# EAGLE design rfid_module_v3 (EAGLE 8.0.1)

## Sheet 1 of 2: RFID Module V3
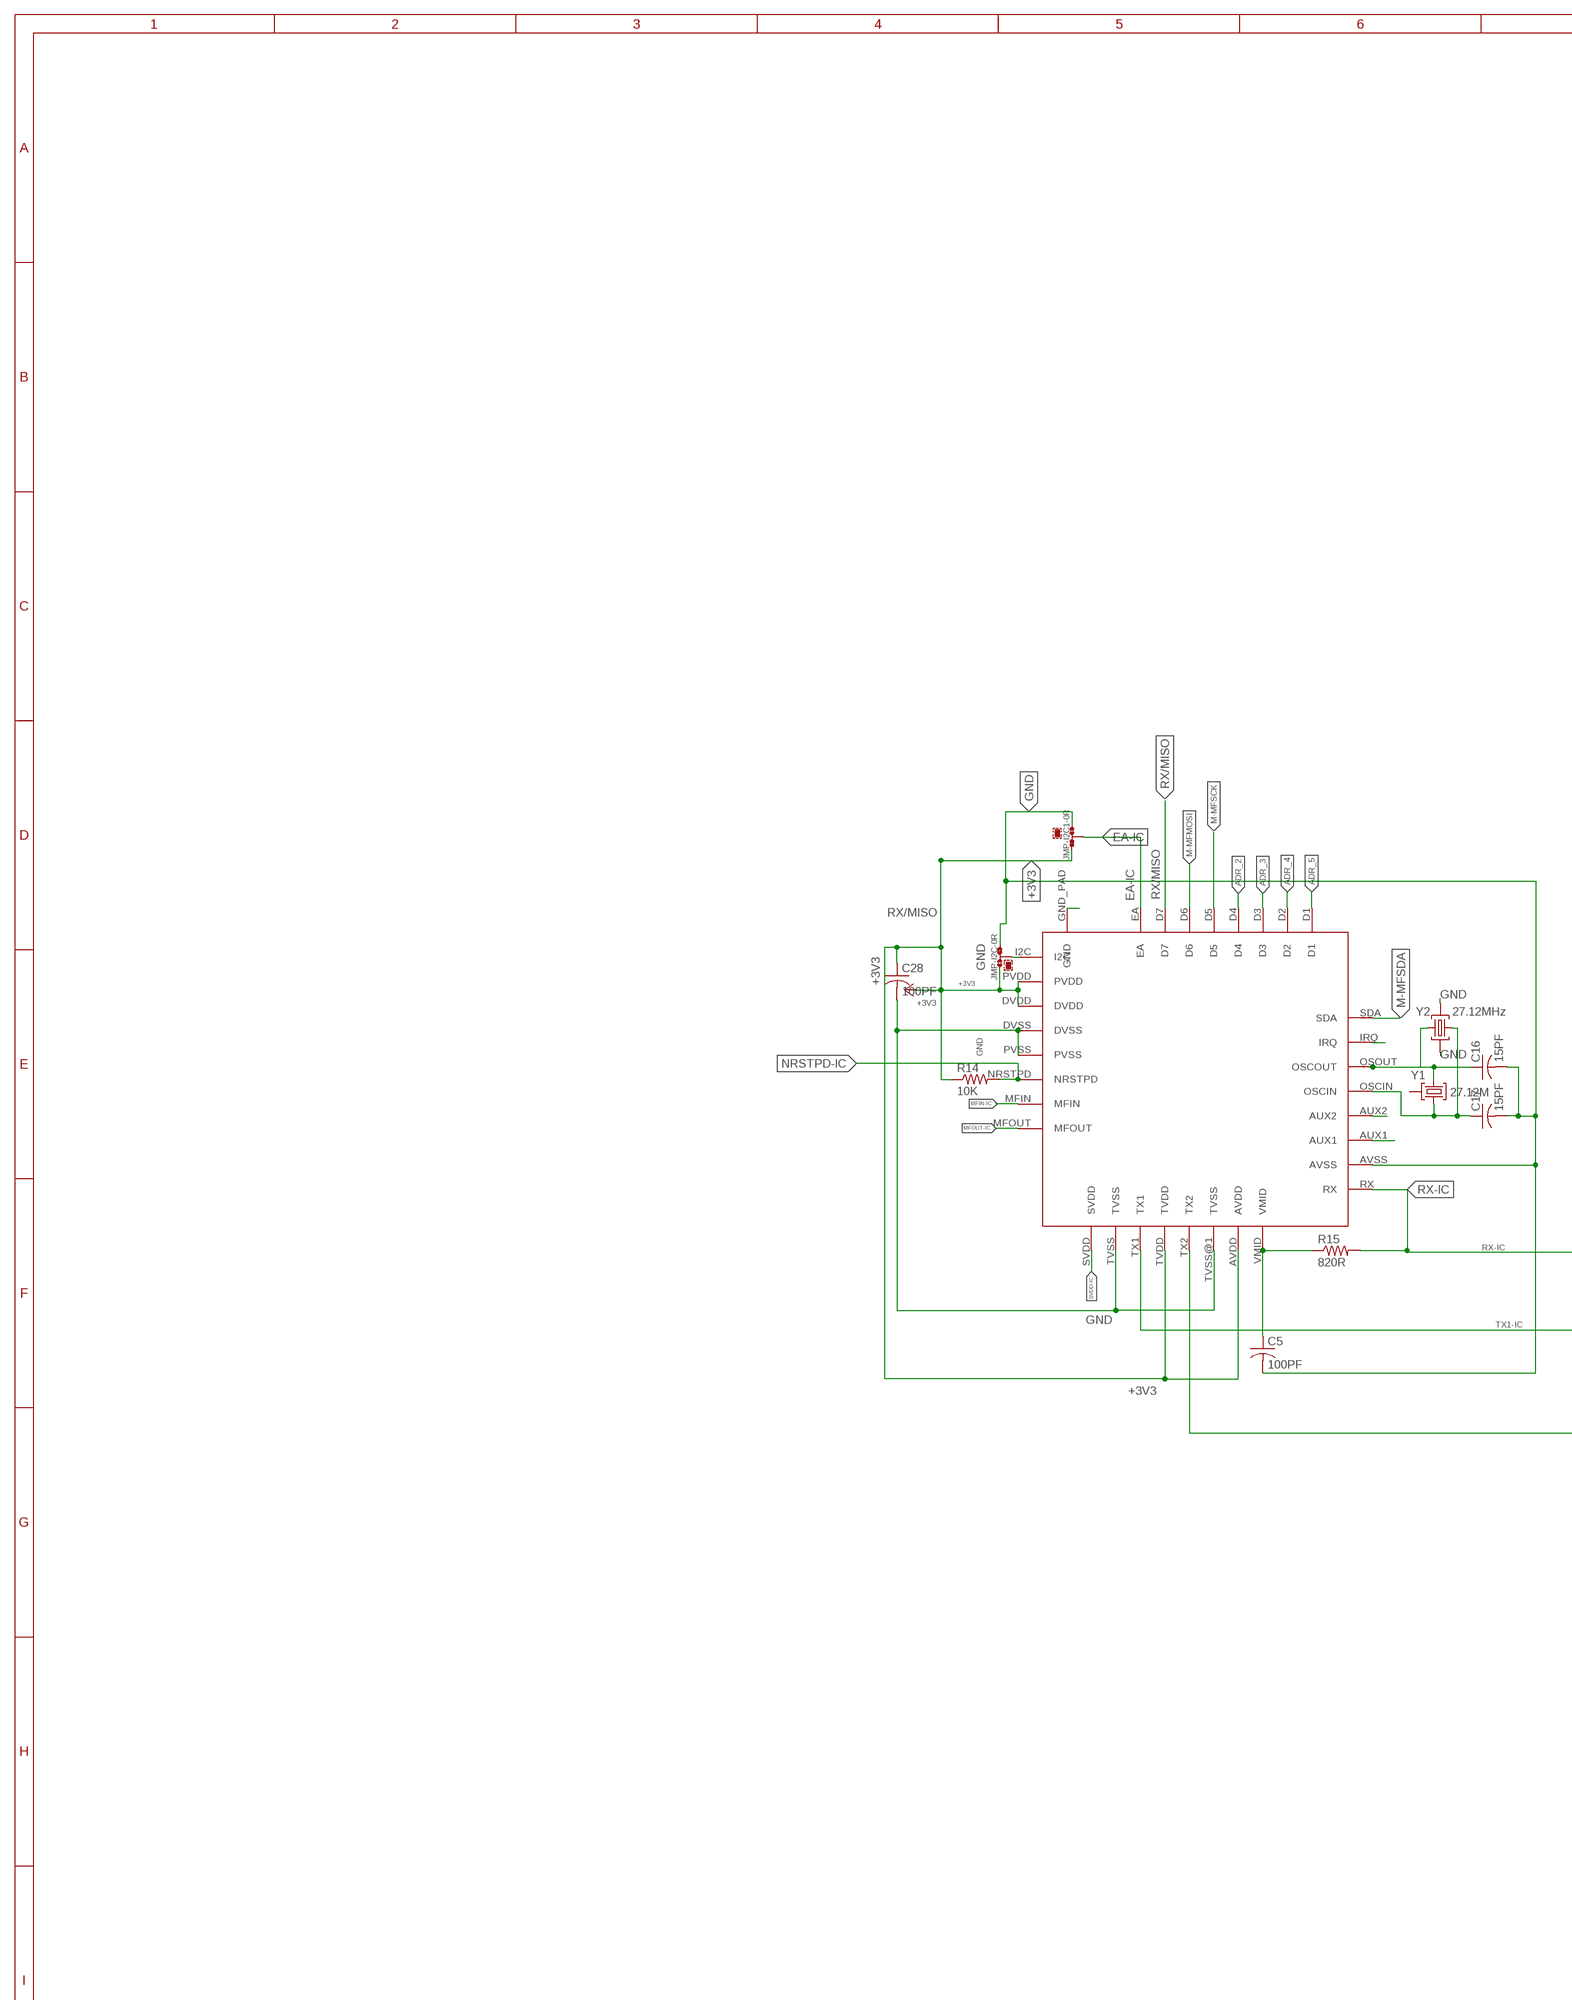
[diagram p0: schematic, sheet 1, part 1 of 2]
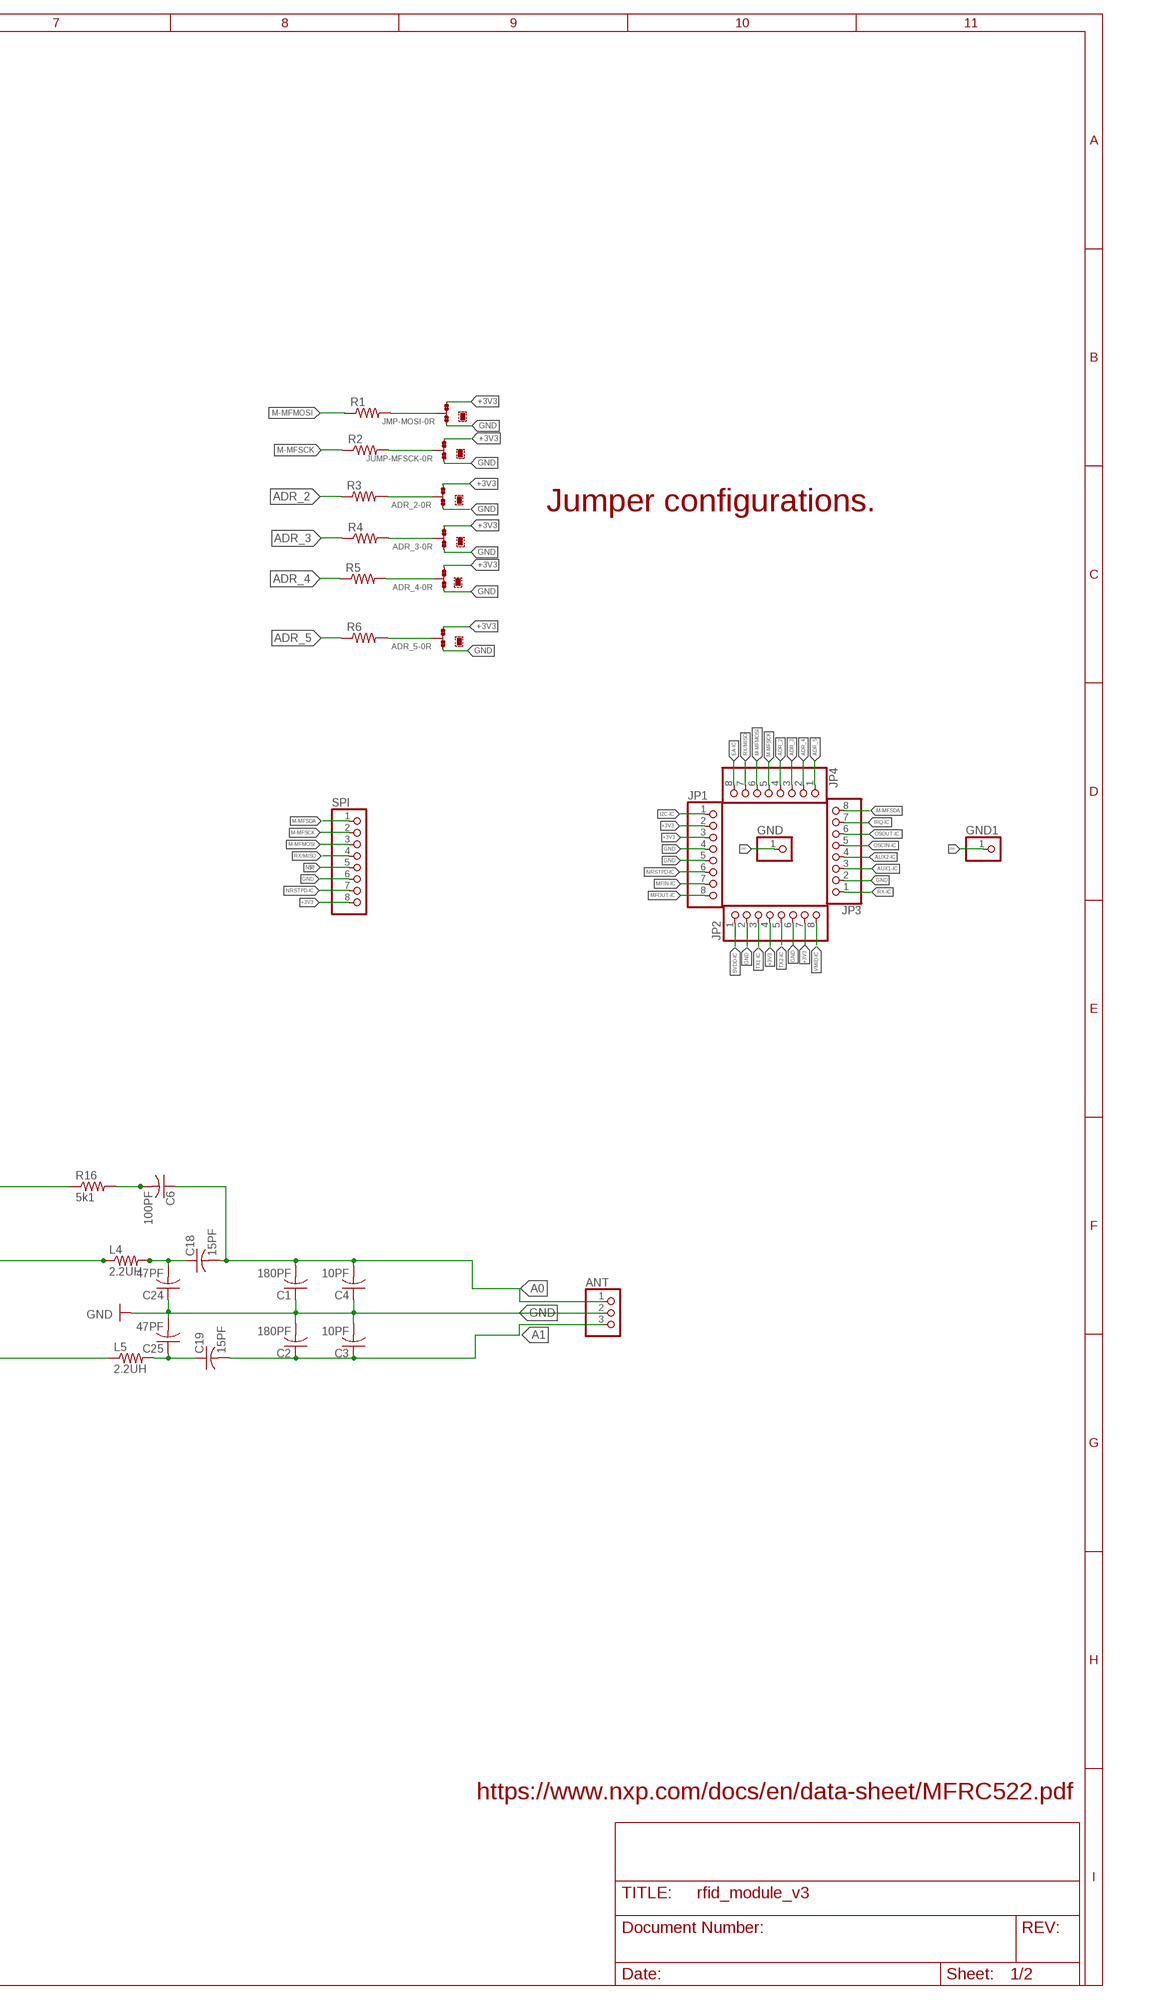
[diagram p1: schematic, sheet 1, part 2 of 2]

### Parts
ADR_2  0R-JUMPA  [A0R-JMP]
ADR_3  0R-JUMPA  [A0R-JMP]
ADR_4  0R-JUMPA  [A0R-JMP]
ADR_5  0R-JUMPA  [A0R-JMP]
ANT  PINHD-1X3  [1X03]
C1  180PF  C-USC0603  [C0603]
C2  180PF  C-USC0603  [C0603]
C3  10PF  C-USC0603  [C0603]
C4  10PF  C-USC0603  [C0603]
C5  100PF  C-USC0603  [C0603]
C6  100PF  C-USC0603  [C0603]
C16  15PF  C-USC0603  [C0603]
C17  15PF  C-USC0603  [C0603]
C18  15PF  C-USC0603  [C0603]
C19  15PF  C-USC0603  [C0603]
C24  47PF  C-USC0603  [C0603]
C25  47PF  C-USC0603  [C0603]
C28  100PF  C-USC0603  [C0603]
GND  PINHD-1X1  [1X01]
GND1  PINHD-1X1  [1X01]
JMP-I2C  0R-JUMPA  [A0R-JMP]
JMP-I2C1  JMP-EA  0R-JUMPA  [A0R-JMP]
JMP-MOSI  0R-JUMPA  [A0R-JMP]
JP1  PINHD-1X8  [1X08]
JP2  PINHD-1X8  [1X08]
JP3  PINHD-1X8  [1X08]
JP4  PINHD-1X8  [1X08]
JUMP-MFSCK  0R-JUMPA  [A0R-JMP]
L4  2.2UH  R-US_R0603  [R0603]
L5  2.2UH  R-US_R0603  [R0603]
R1  R-US_R0603  [R0603]
R2  R-US_R0603  [R0603]
R3  R-US_R0603  [R0603]
R4  R-US_R0603  [R0603]
R5  R-US_R0603  [R0603]
R6  R-US_R0603  [R0603]
R14  10K  R-US_R0603  [R0603]
R15  820R  R-US_R0603  [R0603]
R16  5k1  R-US_R0603  [R0603]
SPI  PINHD-1X8  [1X08]
U$1  MFRC522  [MFRC522]
Y1  27.12M  CRYSTAL  [RAD3LEAD]
Y2  27.12MHz  CRYSTAL-3.2-2.5  [CRYSTAL-3.2-2.5]

### Nets
+3V3: ADR_2.3 ADR_3.3 ADR_4.3 ADR_5.3 C28.1 JMP-I2C1.3 JMP-I2C.3 JMP-MOSI.3 JP1.2 JP1.3 JP2.4 JP2.7 JUMP-MFSCK.3 R14.1 SPI.8 U$1.AVDD U$1.DVDD U$1.PVDD U$1.TVDD ; supply symbol labelled +3.3V
A0: ANT.1 C1.2 C4.2 C6.1 C18.2
A1: ANT.3 C2.1 C3.1 C19.2
ADR_2: JP4.4 R3.1 U$1.D4
ADR_3: JP4.3 R4.1 U$1.D3
ADR_4: JP4.2 R5.1 U$1.D2
ADR_5: JP4.1 R6.1 U$1.D1
AUX1-IC: JP3.3 U$1.AUX1
AUX2-IC: JP3.4 U$1.AUX2
EA-IC: JMP-I2C1.2 JP4.8 U$1.EA
GND: ADR_2.1 ADR_3.1 ADR_4.1 ADR_5.1 ANT.2 C1.1 C2.2 C3.2 C4.1 C5.2 C16.2 C17.2 C24.1 C25.2 C28.2 GND1.1 GND.1 JMP-I2C1.1 JMP-I2C.1 JMP-MOSI.1 JP1.4 JP1.5 JP2.2 JP2.6 JP3.2 JUMP-MFSCK.1 SPI.6 U$1.AVSS U$1.DVSS U$1.GND_PAD(GND) U$1.PVSS U$1.TVSS U$1.TVSS@1(TVSS) Y2.2(GND) Y2.4(GND)
I2C-IC: JMP-I2C.2 JP1.1 U$1.I2C
IRQ-IC: JP3.7 U$1.IRQ
M-MFMOSI: JP4.6 R1.1 SPI.3 U$1.D6
M-MFSCK: JP4.5 R2.1 SPI.2 U$1.D5
M-MFSDA: JP3.8 SPI.1 U$1.SDA
MFIN-IC: JP1.7 U$1.MFIN
MFOUT-IC: JP1.8 U$1.MFOUT
N$2: C18.1 C24.2 L4.2
N$4: JMP-MOSI.2 R1.2
N$6: C19.1 C25.1 L5.2
N$8: SPI.5
N$9: JUMP-MFSCK.2 R2.2
N$10: C6.2 R16.2
N$11: ADR_2.2 R3.2
N$12: ADR_3.2 R4.2
N$13: ADR_4.2 R5.2
N$14: ADR_5.2 R6.2
NRSTPD-IC: JP1.6 R14.2 SPI.7 U$1.NRSTPD
OSCIN-IC: C17.1 JP3.5 U$1.OSCIN Y1.1 Y2.1(C1)
OSOUT-IC: C16.1 JP3.6 U$1.OSOUT(OSCOUT) Y1.3 Y2.3(C2)
RX-IC: JP3.1 R15.2 R16.1 U$1.RX
RX/MISO: JP4.7 SPI.4 U$1.D7
SVDD-IC: JP2.1 U$1.SVDD
TX1-IC: JP2.3 L4.1 U$1.TX1
TX2-IC: JP2.5 L5.1 U$1.TX2
VMID-IC: C5.1 JP2.8 R15.1 U$1.VMID
Unconnected: Y1.2

### Notes on the sheet
- Jumper configurations.
- https://www.nxp.com/docs/en/data-sheet/MFRC522.pdf

## Sheet 2 of 2: Notes
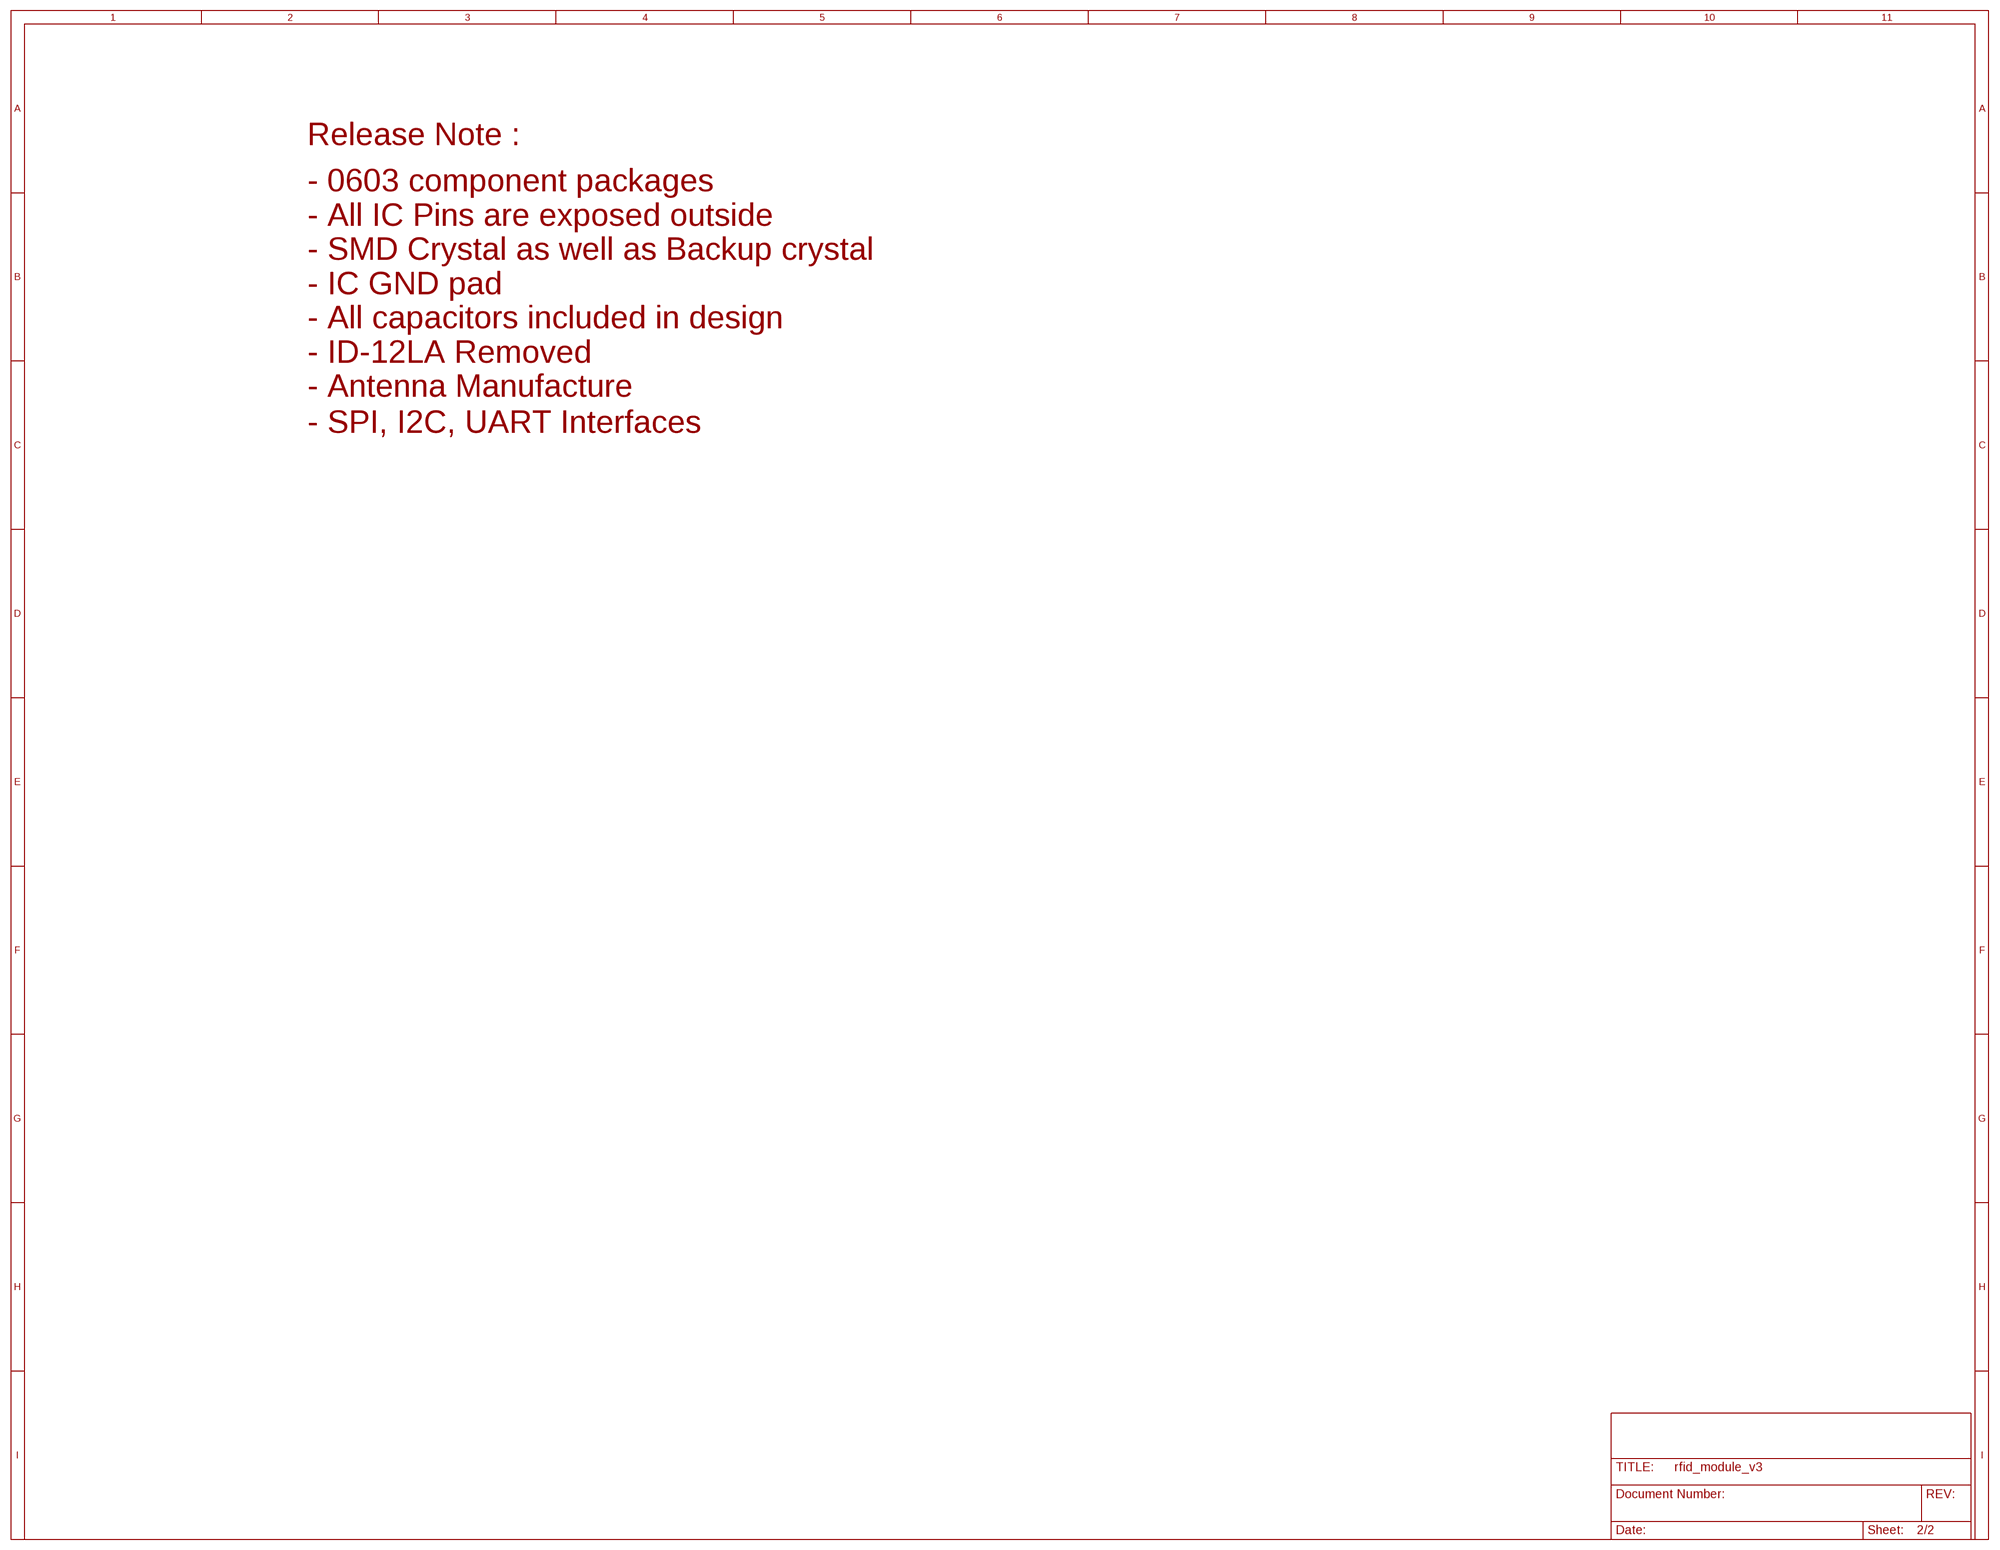
[diagram p2: schematic, sheet 2]

### Notes on the sheet
- Release Note :
- - 0603 component packages
  - All IC Pins are exposed outside
  - SMD Crystal as well as Backup crystal
  - IC GND pad
  - All capacitors included in design
  - ID-12LA Removed
  - Antenna Manufacture
- - SPI, I2C, UART Interfaces

## Library data of the parts
ADR_2-ADR_5 JMP-I2C JMP-I2C1 JMP-MOSI JUMP-MFSCK = jump-0r-smd:0R-JUMP: SMD 0R 0805 Jumper
ANT = pinhead:PINHD-1X3: PIN HEADER
C1-C6 C16-C19 C24 C25 C28 = rcl:C-US: CAPACITOR, American symbol
GND GND1 = pinhead:PINHD-1X1: PIN HEADER
JP1-JP4 SPI = pinhead:PINHD-1X8: PIN HEADER
L4 L5 R1-R6 R14-R16 = rcl:R-US_: RESISTOR, American symbol
U$1 = mfrc522:MFRC522
Y1 = RFID Reader Part Library (1):CRYSTAL
Y2 = SmartPrj:CRYSTAL-3.2-2.5

## Net classes
0 default: width 0.254 mm, drill 0.229 mm, clearance 0.203 mm

## Board
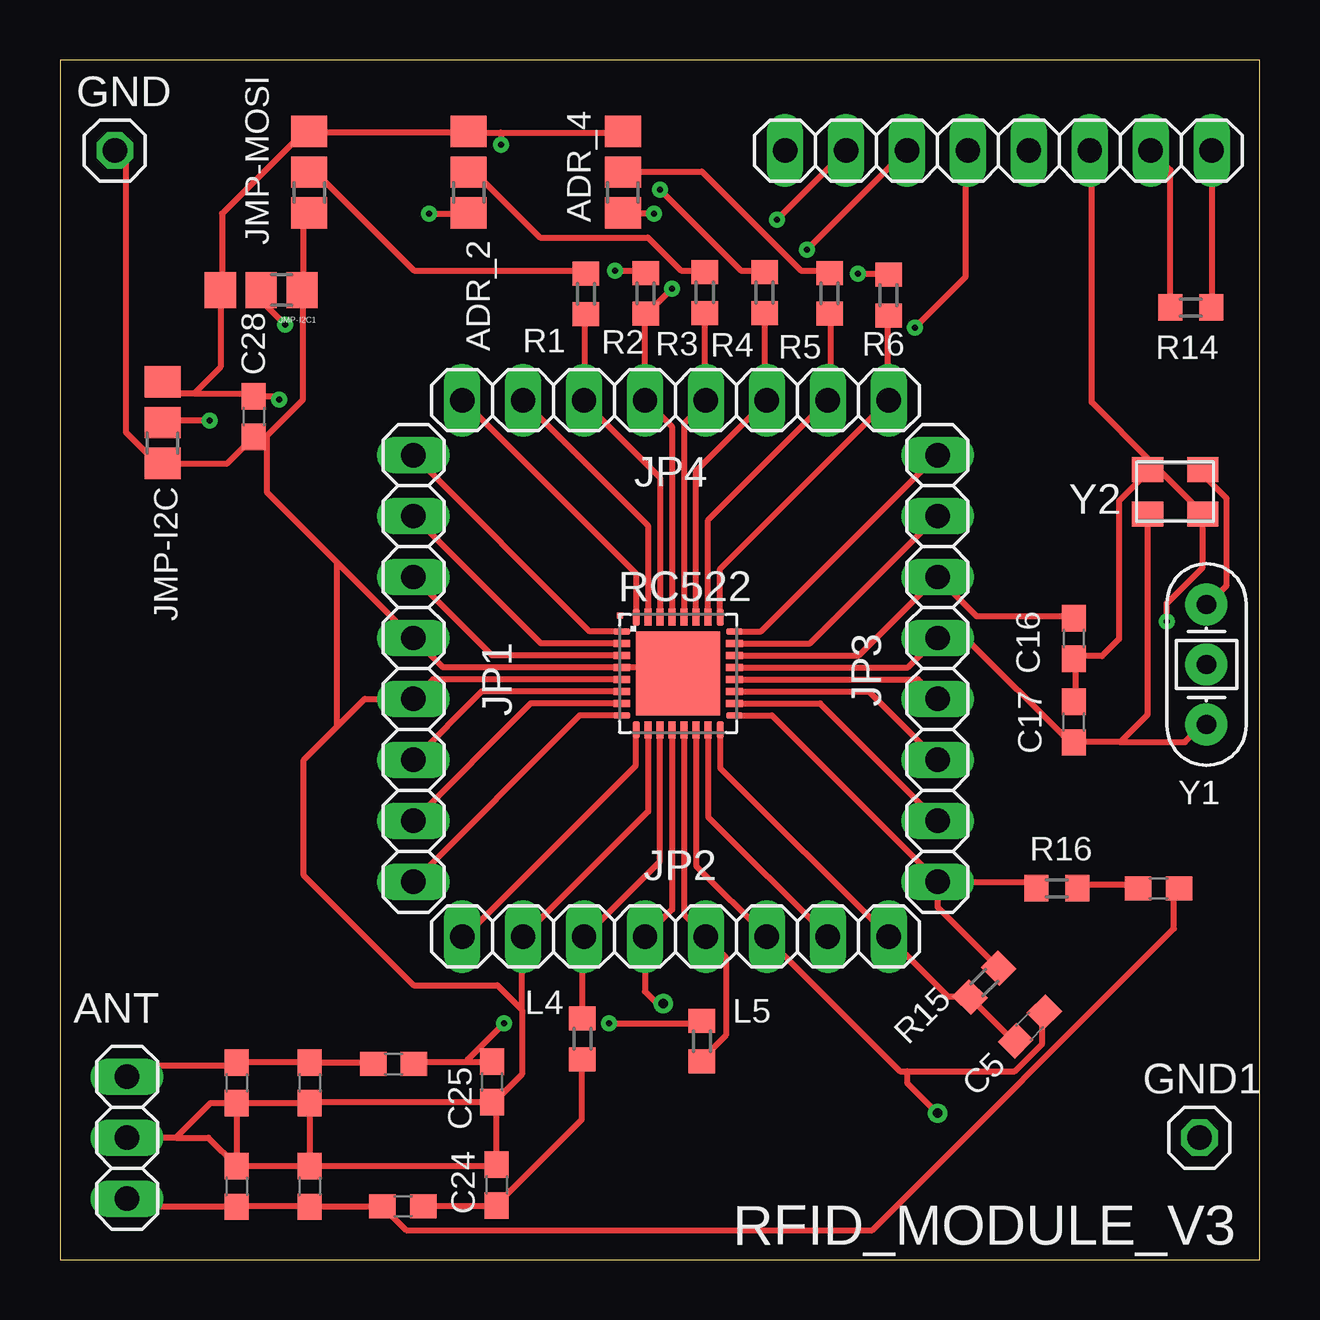
[diagram p3: board, top side]
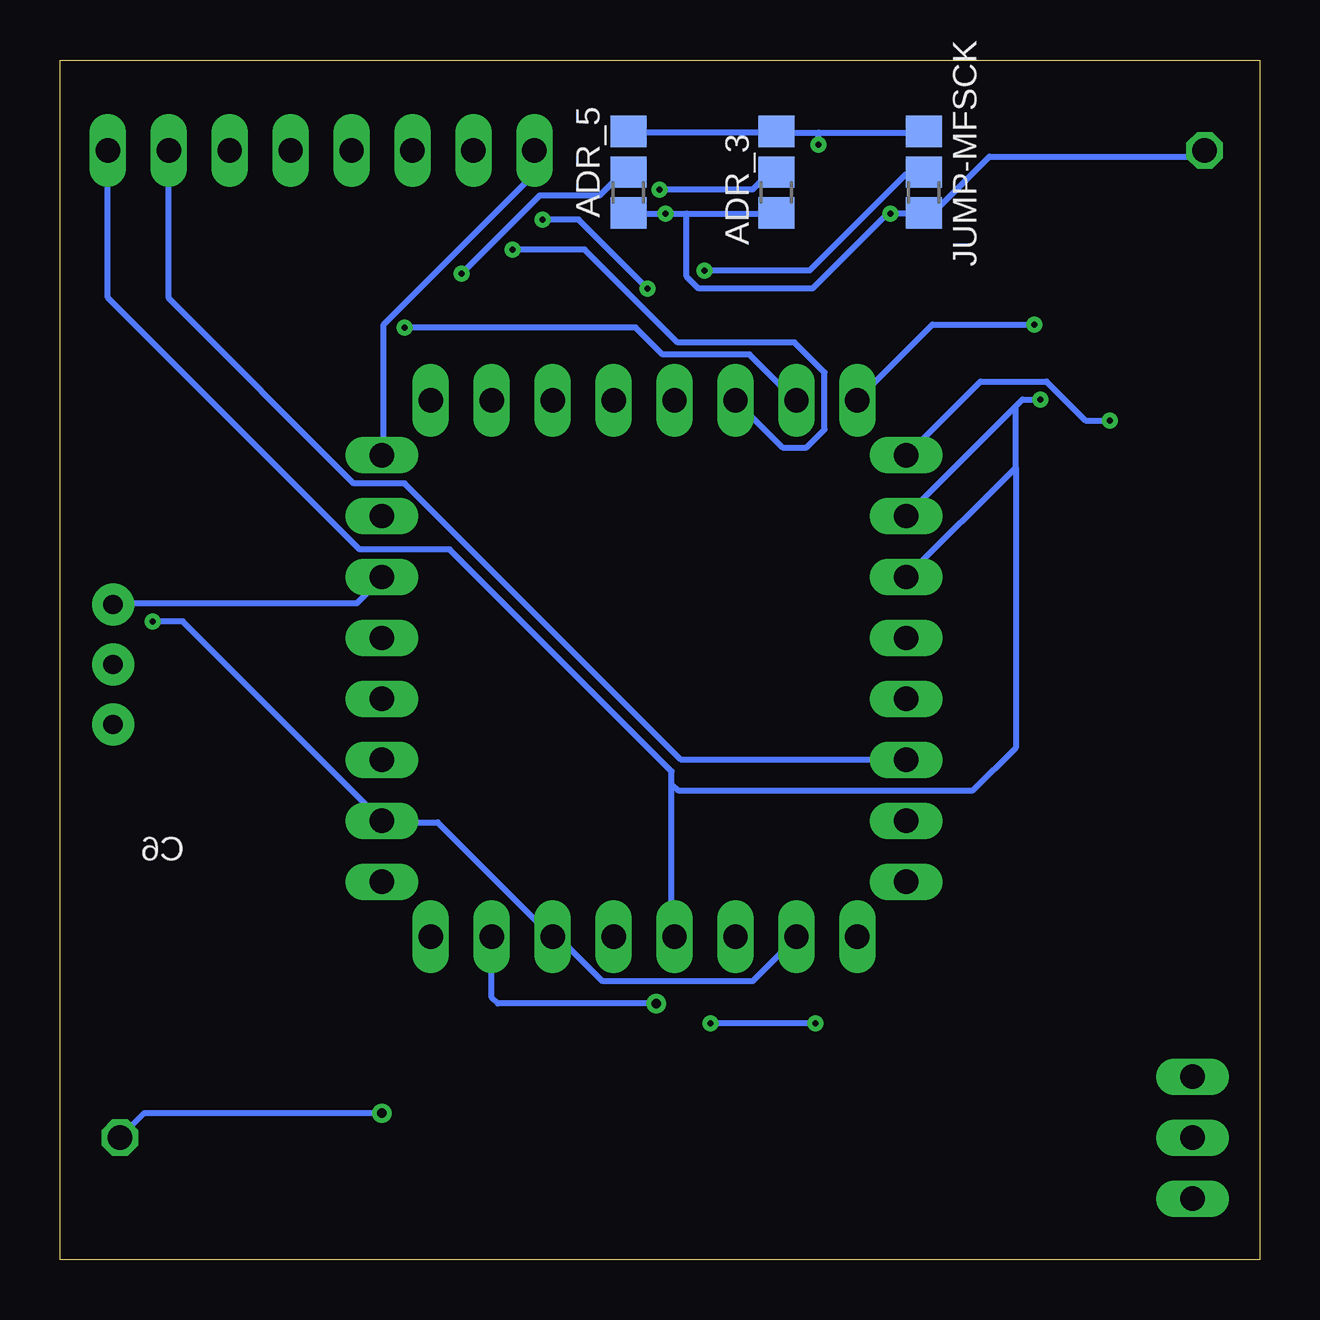
[diagram p4: board, bottom side, seen from below]

Size 50 x 50 mm. Coordinates in mm from the lower left corner, seen from the top.
Outline: 0,0 50,0 50,50 0,50 0,0
Copper layers (1*16): Top 0.035mm / dielectric 1.5mm / Bottom 0.035mm
Design rules "default *": minimum track width 10mil, minimum drill 10mil, track to track 8mil, track to pad 8mil, pad to pad 8mil, via to via 8mil, smd to smd 8mil, copper to edge 40mil, drill to drill 8mil, minimum pad ring 10mil, minimum via ring 8mil, stop-mask expansion 4mil, vias tented up to drill 0mil, thermal gap 10mil

### Footprints (pad centres in the part's own frame; a part is rotated, then mirrored left to right if it is on the bottom)
A0R-JMP = smd 1.5 x 1.3: 1 0,1.7; 2 0,0; 3 0,-1.7
1X03 = drill 1.016 long: 1 -2.54,0; 2 0,0; 3 2.54,0
C0603 = smd 1.1 x 1: 1 -0.85,0; 2 0.85,0
1X01 = drill 1.016 octagon: 1 0,0
1X08 = drill 1.016 long: 1 -8.89,0; 2 -6.35,0; 3 -3.81,0; 4 -1.27,0; 5 1.27,0; 6 3.81,0; 7 6.35,0; 8 8.89,0
R0603 = smd 1 x 1.1: 1 -0.85,0; 2 0.85,0
MFRC522 = smd 0.7 x 0.28: AUX1 2.35,-0.75; AUX2 2.35,-0.25; AVSS 2.35,-1.25; DVDD -2.35,0.75; DVSS -2.35,0.25; I2C -2.35,1.75; IRQ 2.35,1.25; MFIN -2.35,-1.25; MFOUT -2.35,-1.75; NRSTPD -2.35,-0.75; OSCIN 2.35,0.25; OSOUT 2.35,0.75; PVDD -2.35,1.25; PVSS -2.35,-0.25; RX 2.35,-1.75; SDA 2.35,1.75 | smd 0.28 x 0.7: AVDD 1.25,-2.35; D1 1.75,2.35; D2 1.25,2.35; D3 0.75,2.35; D4 0.25,2.35; D5 -0.25,2.35; D6 -0.75,2.35; D7 -1.25,2.35; EA -1.75,2.35; SVDD -1.75,-2.35; TVDD -0.25,-2.35; TVSS -1.25,-2.35; TVSS@1 0.75,-2.35; TX1 -0.75,-2.35; TX2 0.25,-2.35; VMID 1.75,-2.35 | smd 3.5 x 3.5: GND_PAD 0,0 | smd 0.25 x 0.25: M1 -2.415,2.415
RAD3LEAD = drill 0.8 pad 1.75: 1 -2.5,0; 2 0,0; 3 2.5,0
CRYSTAL-3.2-2.5 = smd 1.3 x 1.05: 1 -1.15,-0.925; 2 1.15,-0.925; 3 1.15,0.925; 4 -1.15,0.925

### Placement (x,y rotation side)
ADR_2  17.03,45.32 180 top
ADR_3  20.14,45.32 180 bottom
ADR_4  23.47,45.32 180 top
ADR_5  26.31,45.32 180 bottom
ANT  2.79,5.08 90 top
C1  10.41,3.05 270 top
C2  10.41,7.37 270 top
C3  7.37,7.37 270 top
C4  7.37,3.05 270 top
C5  40.43,9.71 45 top
C6  45.79,15.48 180 top
C16  42.25,25.89 270 top
C17  42.25,22.4 90 top
C18  14.29,2.22 180 top
C19  13.91,8.16 180 top
C24  18.19,3.11 270 top
C25  18,7.41 270 top
C28  8.08,35.14 270 top
GND  2.29,46.23 0 top
GND1  47.5,5.08 0 top
JMP-I2C  4.27,34.88 180 top
JMP-I2C1  8.39,40.42 270 top
JMP-MOSI  10.39,45.32 180 top
JP1  14.73,24.64 270 top
JP2  25.65,13.46 0 top
JP3  36.58,24.64 90 top
JP4  25.65,35.81 180 top
JUMP-MFSCK  13.99,45.32 180 bottom
L4  21.77,9.2 270 top
L5  26.75,9.1 90 top
R1  21.92,40.25 90 top
R2  24.41,40.27 90 top
R3  26.88,40.31 90 top
R4  29.37,40.3 90 top
R5  32.08,40.27 90 top
R6  34.54,40.2 90 top
R14  47.14,39.68 180 top
R15  38.53,11.54 45 top
R16  41.55,15.48 0 top
SPI  39.12,46.23 0 top
U$1  25.76,24.43 0 top
Y1  47.79,24.8 90 top
Y2  46.48,32 0 top

### Tracks (layer width: path | path; a pad name or v marks a point on that pad's centre or on a via)
+3V3  (via drill 0.25, 0.4)
  Top 0.254: 5.59,36.1 4.75,36.1 4.38,36.48 JMP-I2C.3 | 5.59,36.1 8,36.1 C28.1 8.13,35.98 9,35.98 v9.13,35.85 | 6.75,40.35 JMP-I2C1.3 | 18.38,46.98 17.13,46.98 ADR_2.3 17,46.98 10.5,46.98 JMP-MOSI.3 10.38,46.98 10.13,46.98 6.75,43.6 6.75,40.48 JMP-I2C1.3 | 18.38,46.98 23.38,46.98 ADR_4.3 | 18.38,46.98 v18.38,46.48 | R14.1 48,39.73 SPI.8 | U$1.AVDD 27.01,18.45 JP2.7 31.75,13.48 31.75,14.48 | U$1.TVDD 25.51,14.59 JP2.4 24.38,11.18 24.89,10.67 v25.15,10.67 | U$1.DVDD 18,25.18 JP1.3 | U$1.PVDD 20.04,25.68 JP1.2 | JMP-I2C1.3 6.69,37.2 5.59,36.1
  Bottom 0.254: 18.38,46.98 20.13,46.98 ADR_3.3 20.25,46.98 26.25,46.98 ADR_5.3 | 18.38,46.98 14,46.98 JUMP-MFSCK.3 | v18.38,46.48 18.38,46.98 | 24.5,19.81 24.5,13.48 JP2.4 | 24.5,19.81 24.5,20.35 33.75,29.6 37.5,29.6 48,40.1 SPI.8 | 14.63,28.35 JP1.3 | v9.13,35.85 9.88,35.85 10.16,35.56 | 10.16,35.56 14.63,31.1 JP1.2 14.75,30.98 | 14.75,28.48 JP1.3 | v25.15,10.67 31.75,10.67 32,10.92 JP2.7 | 24.5,19.81 24.25,19.56 11.94,19.56 10.16,21.33 10.16,33.02 | 10.16,33.02 10.16,35.56 | JP1.3 10.16,33.02
A0
  Top 0.254: ANT.1 2.88,2.48 3.13,2.23 7.25,2.23 C4.2 7.38,2.23 10.38,2.23 C1.2 10.5,2.23 13.38,2.23 C18.2 13.51,2.13 14.43,1.22 33.86,1.22 46.43,13.79 46.43,15.39 C6.1
A1
  Top 0.254: C19.2 13,8.23 10.5,8.23 C2.1 10.38,8.23 C3.1 7.25,8.1 3.25,8.1 2.88,7.73 ANT.3
ADR_2
  Top 0.254: U$1.D4 26,26.85 26,34.85 26.88,35.73 JP4.4 26.88,35.85 26.88,39.35 R3.1
ADR_3
  Top 0.254: R4.1 29.38,39.35 29.38,35.85 JP4.3 26.51,32.86 U$1.D3
ADR_4
  Top 0.254: R5.1 32.13,39.35 32.13,35.85 JP4.2 27.01,30.82 U$1.D2
ADR_5
  Top 0.254: R6.1 34.5,39.23 34.5,35.85 JP4.1 27.51,28.78 U$1.D1
AUX1-IC
  Top 0.254: U$1.AUX1 33.73,23.68 JP3.3
AUX2-IC
  Top 0.254: U$1.AUX2 35.77,24.18 JP3.4
EA-IC  (via drill 0.25)
  Top 0.254: U$1.EA 24,26.85 24,28.6 16.88,35.73 JP4.8 | v9.38,38.98 8.5,39.85 8.5,40.35 JMP-I2C1.2
  Bottom 0.254: v9.38,38.98 13.63,38.98 16.75,35.85 JP4.8
GND  (via drill 0.25, 0.4)
  Top 0.254: v24.75,43.6 23.5,43.6 ADR_4.1 | v15.38,43.6 17,43.6 ADR_2.1 | 18,4.1 18.13,3.98 C24.1 | C4.1 7.38,3.98 | 7.38,6.48 C3.2 | C1.1 10.5,3.98 | 10.5,6.48 C2.2 | 2.88,5.1 ANT.2 4.83,5.08 | 19.25,10.41 19.25,7.73 18.13,6.6 C25.2 17.78,6.56 | 19.25,10.41 19.25,13.35 JP2.2 24.51,18.67 U$1.TVSS | JMP-MOSI.1 10.38,43.6 10.13,43.35 10.13,40.48 JMP-I2C1.1 10.13,40.35 10.13,35.85 8.63,34.35 | C28.2 8,34.23 | 4.38,33.1 JMP-I2C.1 | 8.63,34.35 8.13,34.35 C28.2 | 8.63,34.35 8.63,31.98 11.54,29.07 | 11.54,29.07 14.63,25.98 JP1.4 15.96,24.68 U$1.DVSS 25.76,24.68 U$1.GND_PAD | U$1.AVSS 31.69,23.18 JP3.2 | U$1.TVSS@1 26.51,16.41 JP2.6 29.52,13.34 35,7.85 35.31,7.85 | U$1.PVSS 15.54,24.18 JP1.5 12.7,23.37 11.54,22.21 | 11.54,22.21 10.16,20.83 10.16,16 14.73,11.43 18.24,11.43 19.25,10.41 | GND.1 2.75,45.98 2.75,34.48 4.25,32.98 JMP-I2C.1 | Y2.4 45.5,33.23 47.63,31.1 Y2.2 47.63,30.98 47.63,28.85 46.13,27.35 v46.13,26.6 | 11.54,29.07 11.54,22.21 | C17.2 42.32,23.39 42.32,24.99 C16.2 | 35.31,7.85 39.8,7.85 40.95,8.99 40.95,10.13 C5.2 | 42.32,25.22 C16.2 | Y2.4 45.29,32.77 44.15,31.62 44.15,25.86 43.43,25.15 42.36,25.15 C16.2 | SPI.6 43,46.02 43,35.74 45.52,33.22 Y2.4 | JMP-I2C.1 6.97,33.18 C28.2 | 17.78,6.56 10.46,6.56 C2.2 | C2.2 C3.2 | C3.2 6.26,6.52 4.83,5.08 | 4.83,5.08 6.18,5.08 C4.1 | C4.1 C1.1 | C1.1 18.13,3.9 C24.1 | C24.1 18.19,6.14 17.78,6.56 | C2.2 C1.1 | C3.2 C4.1 | 35.31,7.85 35.31,7.37 v36.58,6.1
  Bottom 0.254: 23.88,43.6 v24.75,43.6 26.25,43.6 ADR_5.1 | 23.88,43.6 20.25,43.6 ADR_3.1 | 23.88,43.6 23.88,40.98 23.38,40.48 18.63,40.48 15.5,43.6 v15.38,43.6 14,43.6 JUMP-MFSCK.1 13.75,43.48 11.25,45.98 2.75,45.98 GND.1 | JP2.2 19.38,13.35 21.13,11.6 27.38,11.6 29.13,13.35 29.38,13.35 JP2.6 29.5,13.48 34.25,18.23 36.5,18.23 JP3.2 36.63,18.35 44.88,26.6 v46.13,26.6 | v36.58,6.1 46.48,6.1 GND1.1
I2C-IC  (via drill 0.25)
  Top 0.254: 14.75,33.48 JP1.1 22.08,26.18 U$1.I2C | v6.24,34.98 4.38,34.98 JMP-I2C.2
  Bottom 0.254: v6.24,34.98 7.25,34.98 8.88,36.6 11.63,36.6 14.63,33.6 JP1.1
IRQ-IC
  Top 0.254: U$1.IRQ 31.27,25.68 JP3.7
M-MFMOSI  (via drill 0.25)
  Top 0.254: U$1.D6 25,26.85 25,32.6 21.88,35.73 JP4.6 21.88,35.85 21.88,39.35 R1.1 | v31.13,42.1 35.25,46.23 SPI.3
  Bottom 0.254: v31.13,42.1 28.13,42.1 24.25,38.23 19.38,38.23 18.13,36.98 18.13,34.6 18.88,33.85 19.88,33.85 21.75,35.73 JP4.6
M-MFSCK  (via drill 0.25)
  Top 0.254: U$1.D5 25.5,26.85 25.5,34.73 24.5,35.73 JP4.5 24.38,35.85 24.38,39.35 R2.1 24.5,39.48 v25.5,40.48 | v29.88,43.35 32.75,46.23 SPI.2
  Bottom 0.254: v29.88,43.35 28.38,43.35 v25.5,40.48
M-MFSDA
  Top 0.254: U$1.SDA 29.23,26.18 JP3.8
  Bottom 0.254: SPI.1 30.25,46.23 30.25,45.23 36.5,38.98 36.5,33.6 JP3.8
MFIN-IC
  Top 0.254: U$1.MFIN 19.62,23.18 JP1.7
MFOUT-IC
  Top 0.254: 14.75,15.85 JP1.8 21.66,22.68 U$1.MFOUT
N$2
  Top 0.254: C18.1 15.25,2.23 18.13,2.23 C24.2 18.25,2.35 21.75,5.85 21.75,8.35 L4.2
N$4
  Top 0.254: R1.2 21.88,41.23 14.75,41.23 10.75,45.23 10.5,45.23 JMP-MOSI.2
N$6  (via drill 0.25)
  Top 0.254: 17,8.23 18,8.23 C25.1 | 17,8.23 14.88,8.23 C19.1 | v22.88,9.85 26.63,9.85 L5.2 | v18.5,9.85 17,8.35 17,8.23
  Bottom 0.254: v18.5,9.85 v22.88,9.85
N$9  (via drill 0.25)
  Top 0.254: v23.13,41.23 24.38,41.23 R2.2
  Bottom 0.254: v23.13,41.23 18.75,41.23 14.75,45.23 14,45.23 JUMP-MFSCK.2
N$10
  Top 0.254: R16.2 42.55,15.62 44.83,15.62 C6.2
N$11
  Top 0.254: R3.2 26.75,41.23 25.88,41.23 24.5,42.6 20,42.6 17.38,45.23 17.13,45.23 ADR_2.2
N$12  (via drill 0.25)
  Top 0.254: v25,44.6 28.38,41.23 29.25,41.23 R4.2
  Bottom 0.254: v25,44.6 21.13,44.6 20.5,45.23 20.25,45.23 ADR_3.2
N$13
  Top 0.254: R5.2 32,41.23 30.88,41.23 26.75,45.35 23.5,45.35 ADR_4.2
N$14  (via drill 0.25)
  Top 0.254: v33.25,41.1 34.5,41.1 R6.2
  Bottom 0.254: v33.25,41.1 30,44.35 27.5,44.35 26.63,45.23 26.38,45.23 ADR_5.2
NRSTPD-IC
  Top 0.254: 46.25,39.73 R14.2 46.28,45.41 SPI.7 | U$1.NRSTPD 17.58,23.68 JP1.6
  Bottom 0.254: JP1.6 14.75,20.85 24.13,20.85 35.63,32.35 37.75,32.35 45.47,40.06 SPI.7
OSCIN-IC
  Top 0.254: U$1.OSCIN 35.35,24.68 JP3.5 37.74,25.91 42.09,21.57 C17.1 42.32,21.57 44.2,21.57 | 44.2,21.57 46.89,21.57 47.57,22.25 Y1.1 | 45.29,30.94 Y2.1 45.33,22.7 44.2,21.57
OSOUT-IC
  Top 0.254: U$1.OSOUT 33.31,25.18 JP3.6 38.2,26.82 42.09,26.82 C16.1 | Y2.3 47.75,32.85 47.75,32.6 48.63,31.73 48.63,28.1 47.88,27.35 Y1.3
  Bottom 0.254: Y1.3 47.75,27.35 37.63,27.35 36.63,28.35 JP3.6
RX-IC
  Top 0.254: 39.13,12.35 R15.2 36.58,14.7 JP3.1 | JP3.1 36.63,15.73 29.68,22.68 U$1.RX | 40.49,15.39 R16.1 40.43,15.75 JP3.1
RX/MISO  (via drill 0.25)
  Top 0.254: U$1.D7 24.5,26.85 24.5,30.6 19.38,35.73 JP4.7 | v35.63,38.85 37.75,40.98 37.75,46.23 SPI.4
  Bottom 0.254: v35.63,38.85 26,38.85 24.88,37.73 21.25,37.73 19.38,35.85 JP4.7
SVDD-IC
  Top 0.254: U$1.SVDD 24,21.98 24,20.6 16.88,13.48 JP2.1
TX1-IC
  Top 0.254: U$1.TX1 25,21.98 25,16.6 21.88,13.48 JP2.3 21.75,13.35 21.75,10.1 L4.1
TX2-IC
  Top 0.254: L5.1 26.75,8.35 27.75,9.35 27.75,12.6 27,13.35 JP2.5 26.01,14.37 U$1.TX2
VMID-IC
  Top 0.254: C5.1 39.75,9.1 38,10.85 R15.1 37.88,10.98 37,10.98 34.63,13.35 JP2.8 | JP2.8 34.5,13.48 | U$1.VMID 27.51,20.49 JP2.8

### Text on the board
tNames: RFID_MODULE_V3
tValues: SDA | _ | RST | D5 | D6 | D7 | NC | + | _ | + | RST
bValues: _ | + | _ | +